# EAGLE design Dummy_load_2_(4-30V_0-4.25A)_v2.0 (EAGLE 9.6.2)
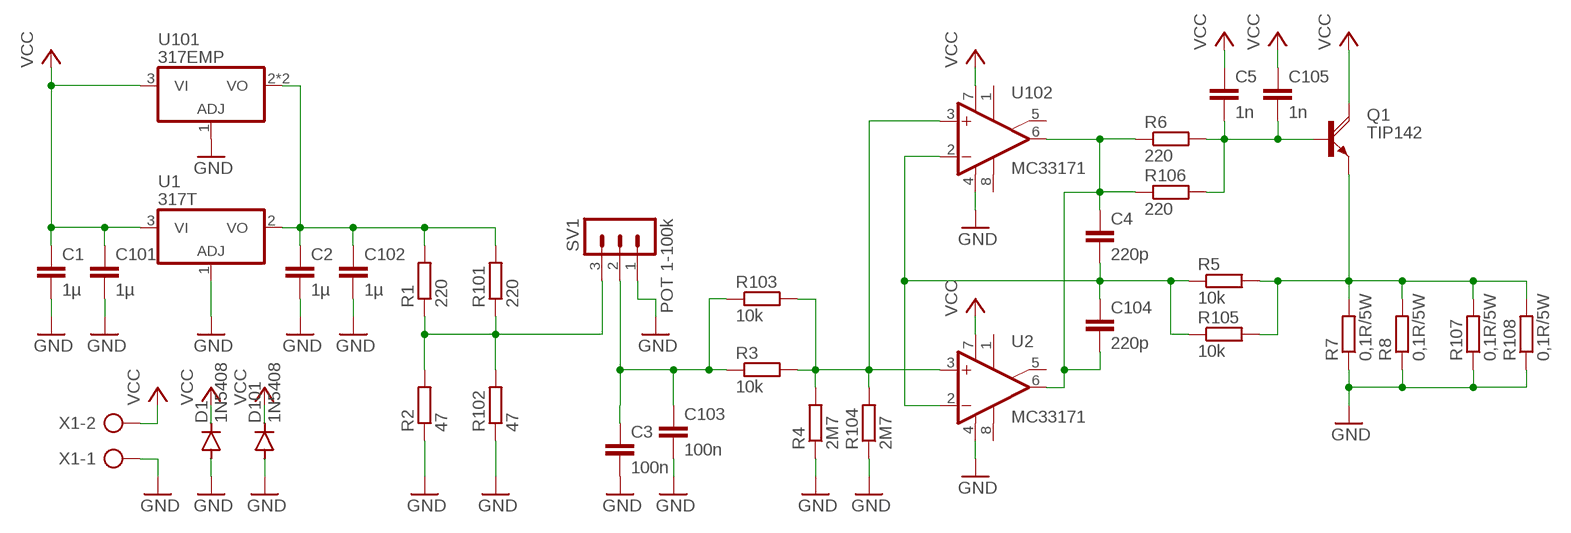
[diagram p0: schematic, sheet 1]

## Parts
C1  1µ  C-EU050-024X044  [C050-024X044]
C2  1µ  C-EU050-024X044  [C050-024X044]
C3  100n  C-EU050-024X044  [C050-024X044]
C4  220p  C-EU050-024X044  [C050-024X044]
C5  1n  C-EU050-024X044  [C050-024X044]
C101  1µ  C-EUC1206  [C1206]
C102  1µ  C-EUC1206  [C1206]
C103  100n  C-EUC1206  [C1206]
C104  220p  C-EUC1206  [C1206]
C105  1n  C-EUC1206  [C1206]
D1  1N5408  DIODE-C1702-06  [C1702-06]
D101  1N5408  DIODE-DO214AA  [DO214AA]
Q1  TIP142  TIP142VERTICAL  [SOT93V]
R1  220  R-EU_0207/10  [0207/10]
R2  47  R-EU_0207/10  [0207/10]
R3  10k  R-EU_0207/10  [0207/10]
R4  2M7  R-EU_0207/10  [0207/10]
R5  10k  R-EU_0207/10  [0207/10]
R6  220  R-EU_0207/10  [0207/10]
R7  0,1R/5W  R-EU_VTA53  [VTA53]
R8  0,1R/5W  R-EU_VTA53  [VTA53]
R101  220  R-EU_R1206  [R1206]
R102  47  R-EU_R1206  [R1206]
R103  10k  R-EU_R1206  [R1206]
R104  2M7  R-EU_R1206  [R1206]
R105  10k  R-EU_R1206  [R1206]
R106  220  R-EU_R1206  [R1206]
R107  0,1R/5W  R-EU_0817/7V  [P0817V]
R108  0,1R/5W  R-EU_0817/7V  [P0817V]
SV1  POT 1-100k  MA03-1  [MA03-1]
U1  317T  [TO220H]
U2  MC33171  LM741P  [DIL08]
U101  317EMP  [SOT223]
U102  MC33171  LM741D  [SO08]
X1  AK500/2  [AK500/2]

## Nets
GND: C1.2 C2.2 C3.2 C101.2 C102.2 C103.2 D1.A D101.A R2.1 R4.1 R7.1 R8.1 R102.1 R104.1 R107.1 R108.1 SV1.1 U1.1(ADJ) U2.4(V-) U101.1(ADJ) U102.4(V-) X1.1
N$1: C2.1 C102.1 R1.2 R101.2 U1.2(VO) U101.2(VO) U101.4(VO)
N$2: R1.1 R2.2 R101.1 R102.2 SV1.3
N$3: C3.1 C103.1 R3.1 R103.1 SV1.2
N$4: R3.2 R4.2 R103.2 R104.2 U2.3(+IN) U102.3(+IN)
N$5: Q1.E R5.2 R7.2 R8.2 R105.2 R107.2 R108.2
N$7: C4.2 C104.1 R5.1 R105.1 U2.2(-IN) U102.2(-IN)
N$8: C4.1 C104.2 R6.1 R106.1 U2.6(OUT) U102.6(OUT)
N$9: C5.2 C105.2 Q1.B R6.2 R106.2
VCC: C1.1 C5.1 C101.1 C105.1 D1.C D101.C Q1.C U1.3(VI) U2.7(V+) U101.3(VI) U102.7(V+) X1.2
Unconnected: U2.1(ON1) U2.5(ON2) U2.8(OPT) U102.1(ON1) U102.5(ON2) U102.8(OPT)

## Library data of the parts
C1-C5 C101-C105 = rcl-custom:C-EU: CAPACITOR, European symbol; SPICEPREFIX: C
D1 D101 = diode-custom:DIODE-: DIODE
Q1 = transistor-power-custom:TIP142: NPN DARLINGTON TRANSISTOR
R1-R8 R101-R108 = rcl-custom:R-EU_: RESISTOR, European symbol; SPICEPREFIX: R
SV1 = con-lstb:MA03-1: PIN HEADER; OC_FARNELL: unknown; OC_NEWARK: unknown
U1 U101 = linear-custom:*317: Positive VOLTAGE REGULATOR
U2 U102 = linear-custom:*741: OP AMP
X1 = con-ptr500-custom:AK500/2: CONNECTOR; OC_FARNELL: unknown; OC_NEWARK: unknown

## Board
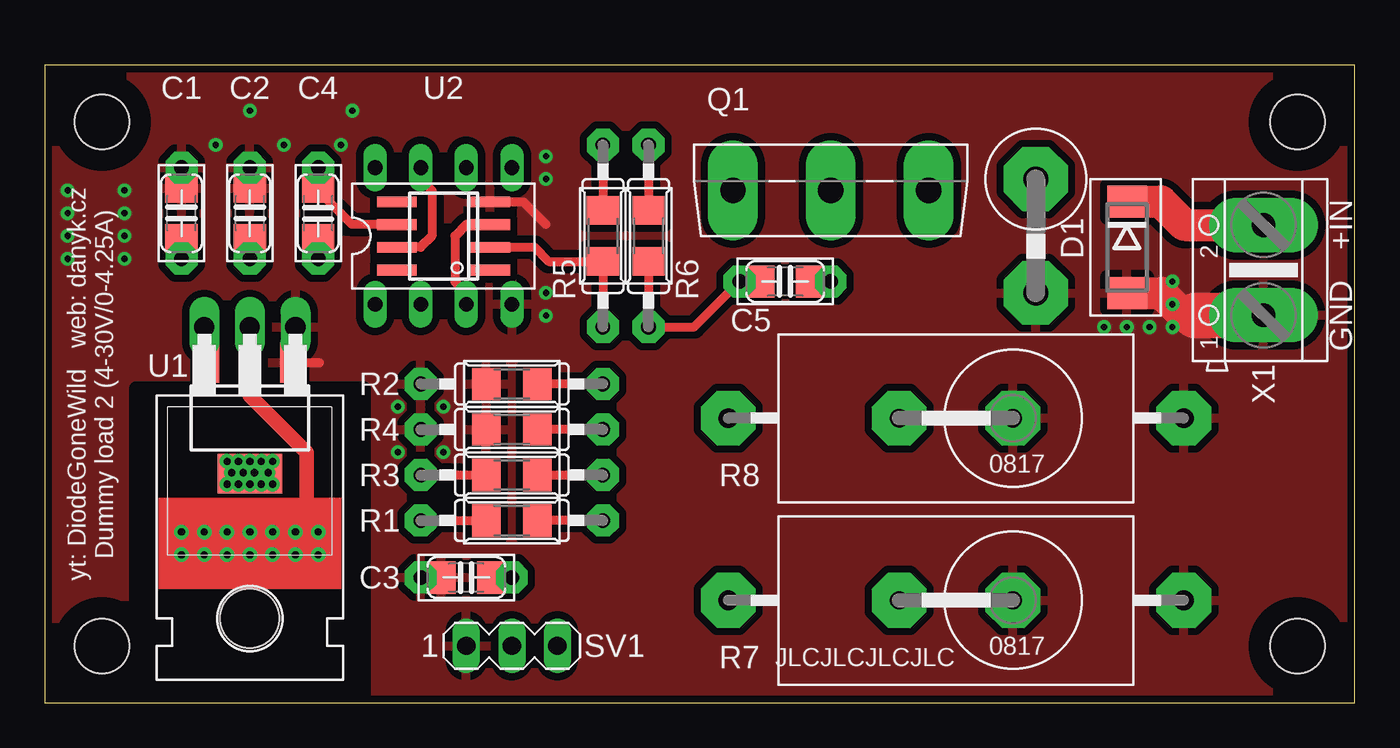
[diagram p1: board, top side]
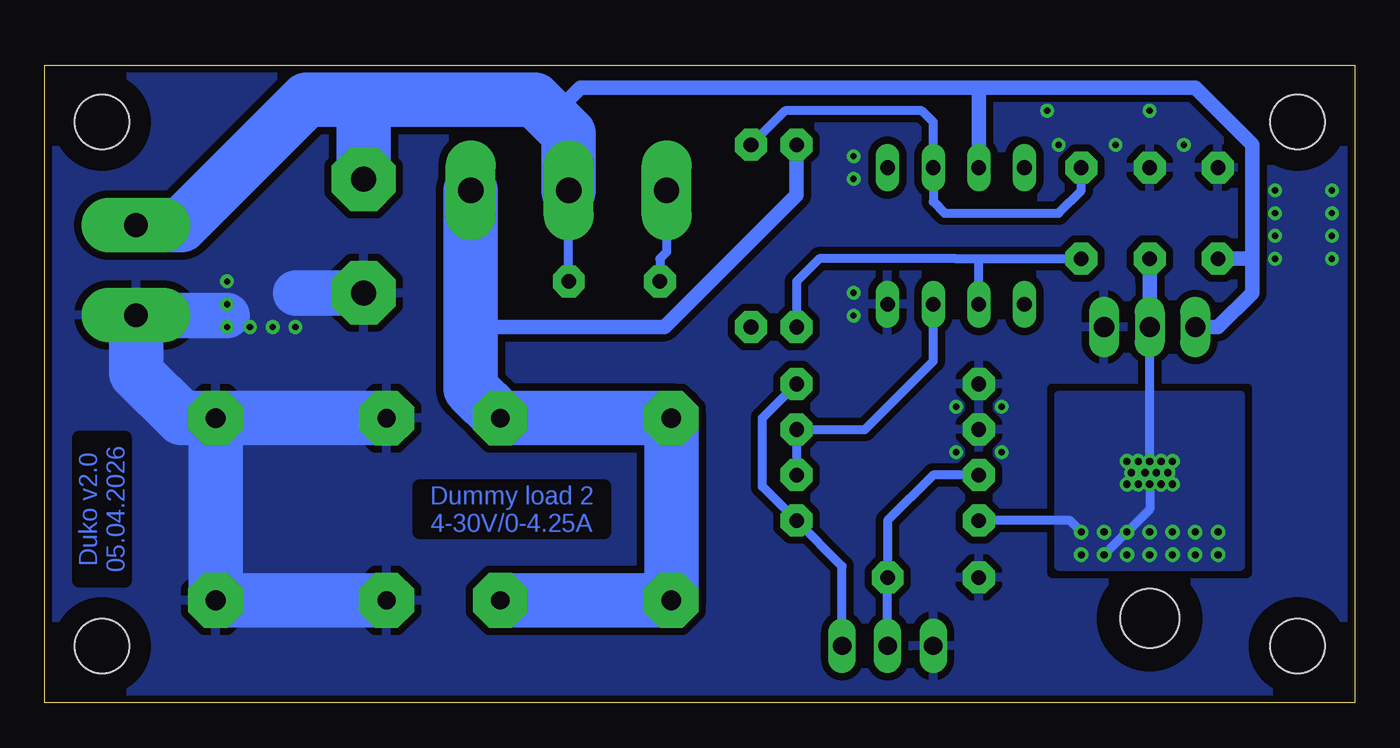
[diagram p2: board, bottom side, seen from below]

Size 73.03 x 35.56 mm. Coordinates in mm from the lower left corner, seen from the top.
Outline: 0,0 73.03,0 73.03,35.56 0,35.56 0,0
Copper layers (1*16): Top 0.035mm / dielectric 1.5mm / Bottom 0.035mm
Design rules "default *": minimum track width 6mil, minimum drill 0.35mm, track to track 6mil, track to pad 6mil, pad to pad 6mil, via to via 6mil, smd to smd 6mil, copper to edge 15mil, drill to drill 6mil, minimum pad ring 10mil, minimum via ring 8mil, stop-mask expansion 4mil, vias tented up to drill 14mil, thermal gap 16mil
Holes 3.05 mm at 3.17,32.38 69.85,32.38 69.85,3.17 3.17,3.17
tRestrict: area 5.1,0.6 to 17.8,17.5; area 1.5,30.7 to 4.9,34.1; area 68.2,30.7 to 71.5,34.1; area 1.5,1.5 to 4.8,4.8; area 68.2,1.5 to 71.5,4.9
bRestrict: area 1.5,30.7 to 4.9,34.1; area 68.2,30.7 to 71.5,34.1; area 68.2,1.5 to 71.5,4.9; area 1.5,1.5 to 4.9,4.9

### Footprints (pad centres in the part's own frame; a part is rotated, then mirrored left to right if it is on the bottom)
C050-024X044 = drill 0.813 pad 1.778 octagon: 1 -2.54,0; 2 2.54,0
C1206 = smd 1.6 x 1.8: 1 -1.4,0; 2 1.4,0
C1702-06 = drill 1.397 pad 3.556 octagon: A 3.81,0; C -2.54,0
DO214AA = smd 1.8 x 2.2: A 2.55,0; C -2.55,0
SOT93V = drill 1.397 pad 2.794 long: B -5.461,-2.54; C 0,-2.54; E 5.461,-2.54
0207/10 = drill 0.813 pad 1.778 octagon: 1 -5.08,0; 2 5.08,0
VTA53 = drill 1.1 pad 3.048 octagon: 1 -12.7,0; 2 12.7,0
R1206 = smd 1.6 x 1.803: 1 -1.422,0; 2 1.422,0
P0817V = drill 1.016 pad 3.048 octagon: 1 -5.08,0; 2 1.27,0
MA03-1 = drill 1.016 long: 1 -2.54,0; 2 0,0; 3 2.54,0
TO220H = drill 1.118 long: 1 -2.54,-11.43; 2 0,-11.43; 3 2.54,-11.43 | hole 3.302: 0,4.826
DIL08 = drill 0.813 pad 1.27 long: 1 -3.81,-3.81; 2 -1.27,-3.81; 3 1.27,-3.81; 4 3.81,-3.81; 5 3.81,3.81; 6 1.27,3.81; 7 -1.27,3.81; 8 -3.81,3.81
SOT223 = smd 1.219 x 2.235: 1 -2.311,-3.099; 2 0,-3.099; 3 2.311,-3.099 | smd 3.6 x 2.2: 4 0,3.099
SO08 = smd 0.6 x 2.2: 1 -1.905,-2.6; 2 -0.635,-2.6; 3 0.635,-2.6; 4 1.905,-2.6; 5 1.905,2.6; 6 0.635,2.6; 7 -0.635,2.6; 8 -1.905,2.6
AK500/2 = drill 1.321 pad 3.048 long: 1 -2.515,0; 2 2.515,0

### Placement (x,y rotation side)
C1  7.62,27.3 90 top
C2  11.43,27.3 90 top
C3  23.5,6.99 180 top
C4  15.24,27.3 270 top
C5  41.27,23.5 180 top
C101  7.62,27.3 90 top
C102  11.43,27.3 90 top
C103  23.5,6.99 180 top
C104  15.24,27.3 90 top
C105  41.27,23.5 180 top
D1  55.24,26.67 270 top
D101  60.33,25.4 270 top
Q1  43.81,31.11 0 top
R1  26.04,10.16 180 top
R2  26.04,17.78 0 top
R3  26.04,12.7 0 top
R4  26.04,15.24 0 top
R5  31.11,26.04 90 top
R6  33.66,26.04 270 top
R7  50.8,5.71 180 top
R8  50.8,15.88 180 top
R101  26.04,10.16 180 top
R102  26.04,17.78 0 top
R103  26.04,12.7 0 top
R104  26.04,15.24 0 top
R105  31.11,26.04 90 top
R106  33.66,26.04 270 top
R107  48.9,5.71 180 top
R108  48.9,15.88 180 top
SV1  26.04,3.17 0 top
U1  11.43,9.53 180 top
U2  22.23,26.04 0 top
U101  11.43,15.88 180 top
U102  22.23,26.04 90 top
X1  67.94,24.13 90 top

### Tracks (layer width: path | path; a pad name or v marks a point on that pad's centre or on a via)
GND  (via drill 0.35)
  Top 0.508: U1.1 13.97,19.2 U101.1 15.32,18.97 | U102.4 26.67,27.94 27.94,26.67
  Top 1.778: X1.1 67.92,21.59 | D101.A 62.24,22.85 | 62.24,22.85 63.5,21.59 62.24,22.85
  Top 2.54: 67.92,21.59 64.14,21.59
  Bottom 1.778: X1.1 67.92,21.59
  Bottom 2.54: 67.92,21.59 62.87,21.59 | D1.A 59.05,22.86
  Bottom 3.048: R8.1 65.41,15.88 67.92,18.39 67.92,21.59 | R8.1 R7.1 R107.1 | R108.1 R8.1
  other vias: 22.23,13.97 22.23,16.51 27.94,21.59 27.94,22.86 27.94,29.21 27.94,30.48 19.68,13.97 19.68,16.51 9.53,31.11 13.34,31.11 17.14,33.02 11.43,33.02 16.51,31.11 4.45,28.57 4.45,27.3 4.45,26.04 4.45,24.77 60.33,20.95 61.59,20.95 59.05,20.95 62.87,20.95 62.87,22.23 62.87,23.5 1.27,28.57 1.27,27.3 1.27,26.04 1.27,24.77
  pour Bottom (isolate 0.406, rank 2): -1.91,38.1 -1.91,-2.54 74.3,-2.54 74.3,38.1
  pour Top (isolate 0.406, rank 2): -3.81,40.64 -3.81,-5.08 76.83,-5.08 76.83,40.64
N$1  (via drill 0.4)
  Top 0.508: R1.2 R101.2 | C102.1 C2.1 | U101.4 v11.43,13.46
  Top 0.813: U1.2 U101.2 11.43,17.14 14.61,13.97 14.61,10.16 v13.97,9.53
  Bottom 0.508: U1.2 v11.43,13.46 v11.43,12.19 11.43,10.79 v13.97,8.26 | v15.24,9.53 15.88,10.16 R1.2
  Bottom 0.813: C2.1 11.43,23.5 U1.2
  other vias: 10.16,13.46 12.7,13.46 12.7,12.19 10.16,12.19 10.79,13.46 10.41,12.83 10.79,12.19 11.05,12.83 12.06,13.46 11.68,12.83 12.06,12.19 12.45,12.83 7.62,9.53 8.89,9.53 10.16,9.53 11.43,9.53 12.7,9.53 7.62,8.26 8.89,8.26 10.16,8.26 11.43,8.26 12.7,8.26 15.24,8.26
  pour Bottom: 6.35,17.14 16.51,17.14 16.51,7.62 6.35,7.62
N$2
  Top 0.508: R2.2 R102.2 | R1.1 R101.1
  Bottom 0.508: SV1.3 28.57,7.62 R1.1 33.02,12.06 33.02,15.88 R2.2
N$3
  Top 0.508: R3.1 R103.1 | C103.1 C3.1
  Bottom 0.508: R3.1 23.5,12.7 26.04,10.16 C3.1 SV1.2
N$4
  Top 0.508: R4.2 R104.2 | U102.3 23.5,26.67 22.86,26.04 22.86,23.5 23.5,22.86 U2.3 | R103.2 R3.2
  Bottom 0.508: R3.2 R4.2 27.3,15.24 23.5,19.05 U2.3
N$5
  Top 0.508: R5.2 R105.2
  Bottom 0.813: 49.28,20.95 38.48,20.95 31.11,28.32 R5.2
  Bottom 3.048: Q1.E 49.28,20.95 49.28,17.53 R108.2 R8.2 R7.2 R107.2
N$7
  Top 0.508: R5.1 R105.1 28.09,24.61 27.3,25.4 U102.2 | C4.2 C104.1
  Bottom 0.508: 20.95,24.77 22.23,24.77 29.84,24.77 31.11,23.5 R5.1 | 20.95,24.77 C4.2 | U2.2 20.95,24.77
N$8
  Top 0.508: C4.1 C104.2 15.24,28.57 17.14,26.67 U102.6 | R6.1 R106.1
  Bottom 0.508: C4.1 15.24,28.57 16.51,27.3 22.86,27.3 23.5,27.94 U2.6 23.5,32.38 24.13,33.02 31.75,33.02 R6.1
N$9
  Top 0.508: R106.2 R6.2 36.2,20.95 C5.2
  Top 0.813: C5.2 C105.2
  Bottom 0.508: Q1.B 38.35,25.15 38.73,24.77 C5.2
VCC
  Top 0.508: U2.7 20.95,29.21 21.59,28.57 21.59,26.04 20.95,25.4 U102.7 | U1.3 9.12,20.73 U101.3 | C1.1 C101.1
  Top 0.813: C105.1 C5.1
  Top 1.778: D101.C 62.22,27.95 63.52,26.64 X1.2
  Bottom 0.508: C5.1 Q1.C
  Bottom 0.813: 20.95,34.29 20.83,34.29 8.89,34.29 5.71,31.11 5.71,24.77 | 20.95,34.29 43.17,34.29 43.81,33.65 Q1.C | U1.3 7.62,20.95 5.71,22.86 5.71,24.77 | C1.1 5.71,24.77 | U2.7 20.95,34.29
  Bottom 3.048: 55.24,33.65 45.72,33.65 43.81,31.74 Q1.C | 55.24,33.65 58.43,33.65 65.43,26.64 X1.2 | D1.C 55.24,33.65
(copper drawn outside any net)
  shapes: Top area x1

### Text on the board
Bottom: Dummy load 2 / 4-30V/0-4.25A | Duko v2.0 / 05.04.2026
tNames: +IN | GND | yt: DiodeGoneWild web: danyk.cz / Dummy load 2 (4-30V/0-4.25A) | JLCJLCJLCJLC